# EAGLE design pcb_usb_buttons_deepsleep (EAGLE 7.6.0)
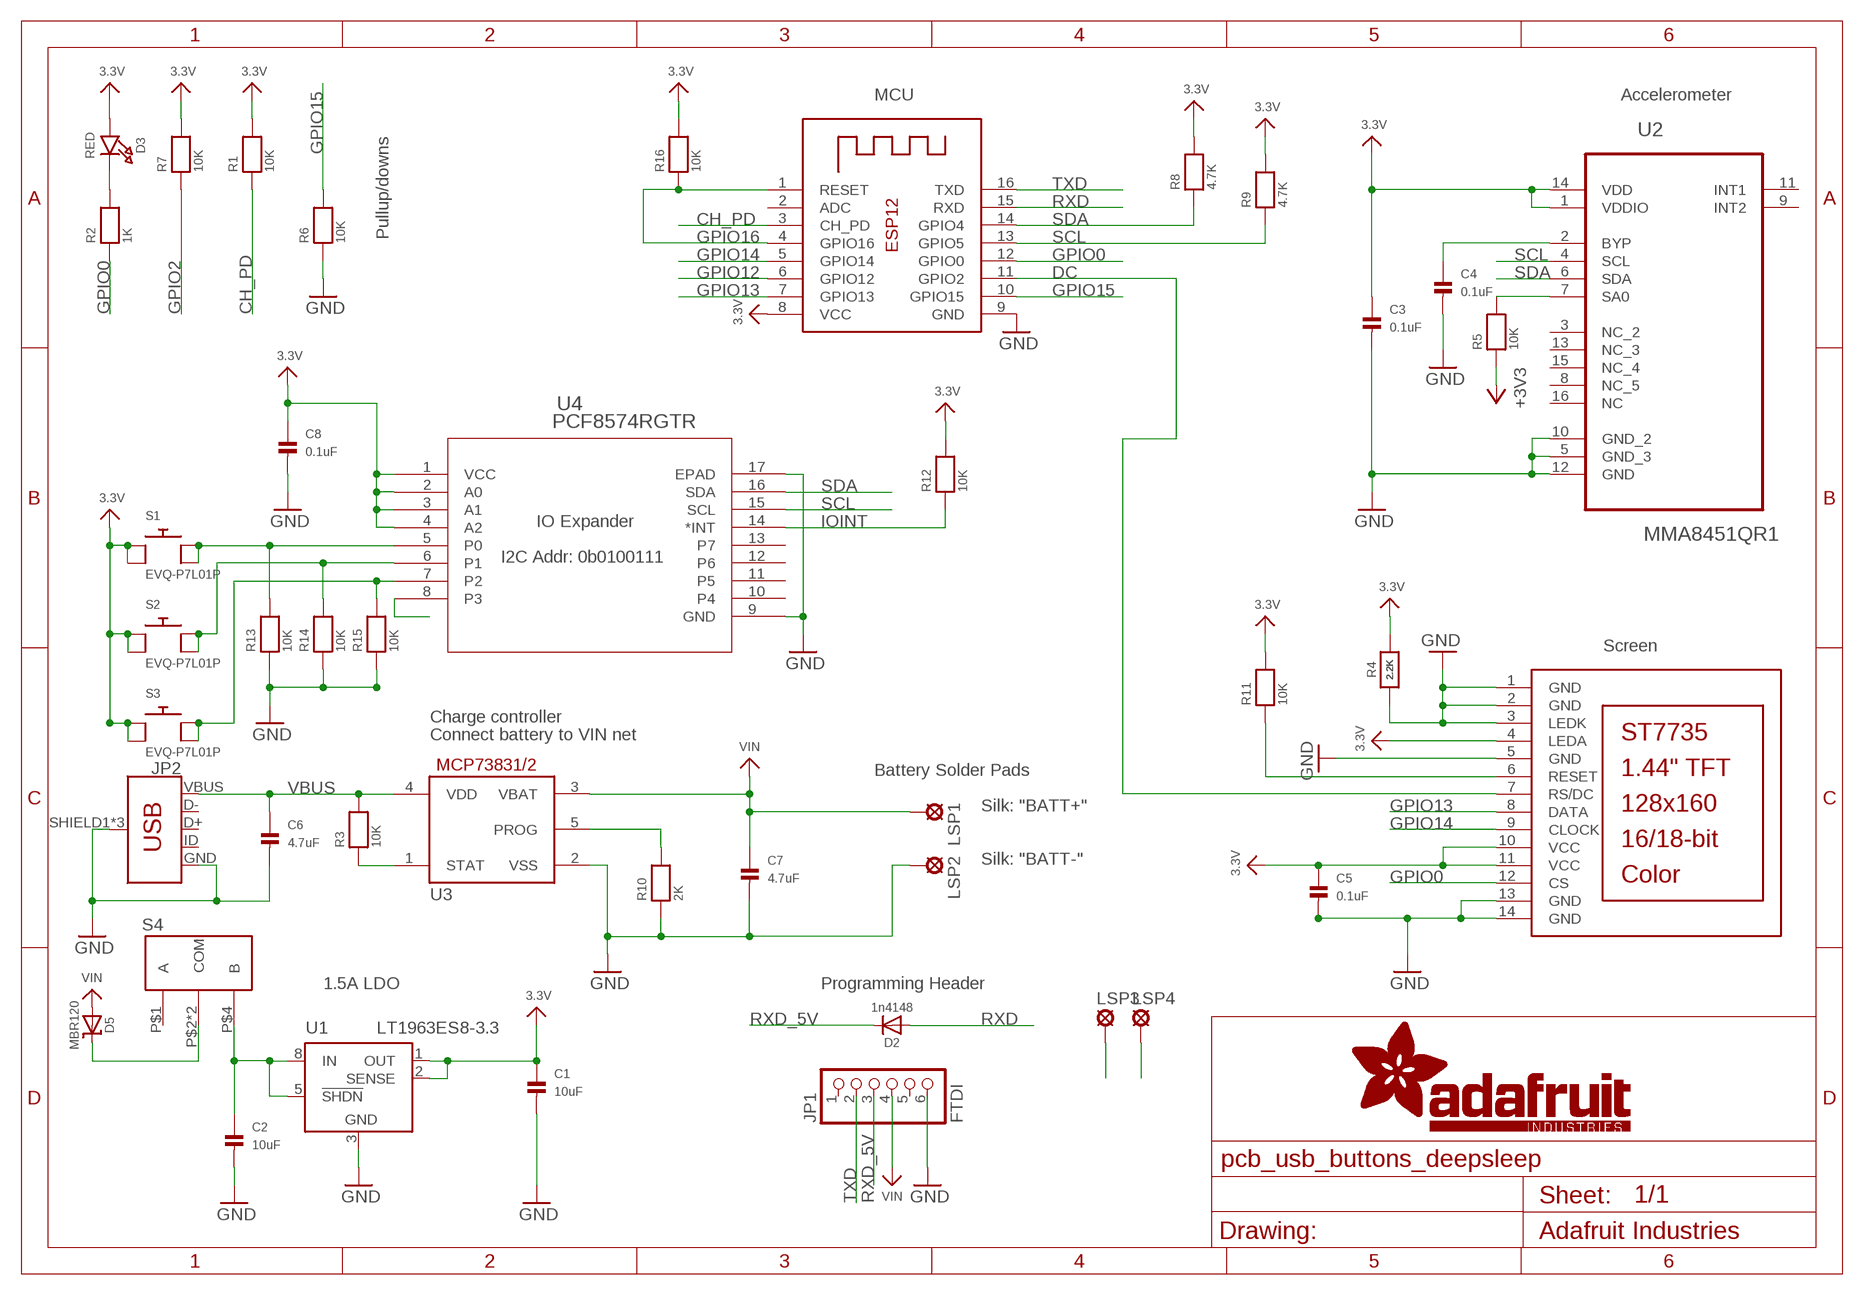
[diagram p0: schematic, sheet 1]

## Parts
C1  10uF  CAP_CERAMIC0805  [0805]
C2  10uF  CAP_CERAMIC0805  [0805]
C3  0.1uF  CAP_CERAMIC0805  [0805]
C4  0.1uF  CAP_CERAMIC0805  [0805]
C5  0.1uF  CAP_CERAMIC0805  [0805]
C6  4.7uF  CAP_CERAMIC0805  [0805]
C7  4.7uF  CAP_CERAMIC0805  [0805]
C8  0.1uF  CAP_CERAMIC0805  [0805]
D2  1n4148  DIODESOD-323  [SOD-323]
D3  RED  LED0805_NOOUTLINE  [CHIPLED_0805_NOOUTLINE]
D5  MBR120  DIODE-SCHOTTKYSOD-123  [SOD-123]
JP1  FTDI  HEADER-1X670MIL  [1X06_ROUND_70]
JP2  USB_MICRO-B_FEMALE-SMT  [USB-B-MICRO-SMD]
LSP1  LSP10  [LSP10]
LSP2  LSP10  [LSP10]
LSP3  LSP10  [LSP10]
LSP4  LSP10  [LSP10]
R1  10K  RESISTOR0805  [0805]
R2  1K  RESISTOR0805  [0805]
R3  10K  RESISTOR0805  [0805]
R4  2.2K  RESISTOR0805_NOOUTLINE  [0805-NO]
R5  10K  RESISTOR0805  [0805]
R6  10K  RESISTOR0805  [0805]
R7  10K  RESISTOR0805  [0805]
R8  4.7K  RESISTOR0805  [0805]
R9  4.7K  RESISTOR0805  [0805]
R10  2K  RESISTOR0805  [0805]
R11  10K  RESISTOR0805  [0805]
R12  10K  RESISTOR0805  [0805]
R13  10K  RESISTOR0805  [0805]
R14  10K  RESISTOR0805  [0805]
R15  10K  RESISTOR0805  [0805]
R16  10K  RESISTOR0805  [0805]
S1  EVQ-P7L01P  [EVQ-P7L]
S2  EVQ-P7L01P  [EVQ-P7L]
S3  EVQ-P7L01P  [EVQ-P7L]
S4  ESD165236  [ESD165236]
TFT1  DISP_LCD_ST7735_1.44IN  [TFT_1.44IN_128_128]
U1  LT1963ES8-3.3  [SOIC8]
U2  MMA8451QR1  [QFN50P300X300X100-16N]
U3  MCP73831/OT  [SOT23-5L]
U4  PCF8574RGTR  [RGT16_1P6X1P6]
X1  ESP-12  [ESP-12]

## Nets
3.3V: C1.1 C3.1 C5.1 C8.1 D3.A R1.2 R4.2 R5.1 R7.2 R8.2 R9.2 R11.2 R12.2 R16.2 S1.P$1 S1.P$1@2 S2.P$1 S2.P$1@2 S3.P$1 S3.P$1@2 TFT1.4(LEDA) TFT1.10(VCC) TFT1.11(VCC) U1.1(OUT) U1.2(SENSE) U2.1(VDDIO) U2.14(VDD) U4.1(VCC) U4.2(A0) U4.3(A1) U4.4(A2) X1.8(VCC) ; supply symbol labelled +3V3
CH_PD: R1.1 X1.3(CH_PD)
DC: TFT1.7(RS/DC) X1.11(GPIO2)
DISC: LSP3.MP U4.8(P3)
GND: C1.2 C2.2 C3.2 C4.2 C5.2 C6.2 C7.2 C8.2 JP1.6 JP2.GND JP2.SHIELD1(SHIELD) JP2.SHIELD2(SHIELD) JP2.SHIELD3(SHIELD) LSP2.MP LSP4.MP R4.1 R6.1 R10.1 R13.1 R14.1 R15.1 TFT1.1(GND) TFT1.2(GND) TFT1.3(LEDK) TFT1.5(GND) TFT1.13(GND) TFT1.14(GND) U1.3(GND) U2.5(GND_3) U2.10(GND_2) U2.12(GND) U3.2(VSS) U4.9(GND) U4.17(EPAD) X1.9(GND)
GPIO0: R2.1 TFT1.12(CS) X1.12(GPIO0)
GPIO2: R7.1
GPIO12: X1.6(GPIO12)
GPIO13: TFT1.8(DATA) X1.7(GPIO13)
GPIO14: TFT1.9(CLOCK) X1.5(GPIO14)
GPIO15: R6.2 X1.10(GPIO15)
GPIO16: R16.1 X1.1(RESET) X1.4(GPIO16)
IOINT: R12.1 U4.14(*INT)
N$1: D3.C R2.2
N$2: C2.1 S4.P$4(B) U1.5(!SHDN) U1.8(IN)
N$4: R11.1 TFT1.6(RESET)
N$5: R3.1 U3.1(STAT)
N$6: R10.2 U3.5(PROG)
N$7: R13.2 S1.P$2 S1.P$2@2 U4.5(P0)
N$8: R5.2 U2.7(SA0)
N$9: C4.1 U2.2(BYP)
N$10: R14.2 S2.P$2 S2.P$2@2 U4.6(P1)
N$11: R15.2 S3.P$2 S3.P$2@2 U4.7(P2)
N$13: D5.C S4.P$2(COM) S4.P$3(COM)
RXD: D2.A X1.15(RXD)
RXD_5V: D2.C JP1.3
SCL: R9.1 U2.4(SCL) U4.15(SCL) X1.13(GPIO5)
SDA: R8.1 U2.6(SDA) U4.16(SDA) X1.14(GPIO4)
TXD: JP1.2 X1.16(TXD)
VBUS: C6.1 JP2.VBUS R3.2 U3.4(VDD)
VIN: C7.1 D5.A JP1.4 LSP1.MP U3.3(VBAT)
Unconnected: JP1.1 JP1.5 JP2.D+ JP2.D- JP2.ID S4.P$1(A) U1.4(NC) U2.3(NC_2) U2.8(NC_5) U2.9(INT2) U2.11(INT1) U2.13(NC_3) U2.15(NC_4) U2.16(NC) U4.10(P4) U4.11(P5) U4.12(P6) U4.13(P7) X1.2(ADC)

## Notes on the sheet
- MCU | Accelerometer
- Pullup/downs
- IO Expander
- I2C Addr: 0b0100111
- Screen
- Charge controller
- Connect battery to VIN net
- Battery Solder Pads
- Silk: "BATT+"
- Silk: "BATT-"
- 1.5A LDO | Programming Header

## Power pins joined to a net without a drawn wire
GND: U1.6(GND) U1.7(GND)

## Library data of the parts
C1-C8 = microbuilder:CAP_CERAMIC: Ceramic Capacitors 0402 - 0402 Surface Mount Capacitors 16pF 50V 5% [Digikey: 445-4899-2-ND] 18pF 50V 5% [Digikey: 490-1281-2-ND] 22pF 50V 5% [Digikey: 490-1283-2-ND] 68pF 50V 5% [Digikey: 490-1289-2-ND] 0.1uF 10V 10% [Digikey: 490-1318-2-ND] 1.0uF 6.3V 10% [Digikey: 490-1320-2-ND] 0603 - 0603 Surface Mount Capacitors 16 pF 50V 5% [Digikey: 445-5051-2-ND] 22 pF 50V [Digikey: PCC220ACVTR-ND] 33 pF 50V 5% [Digikey: 490-1415-1-ND] 56pF 50V 5% [Digikey: 490-1421-1-ND] 220pF 50V 5% [Digikey: 445-1285-1-ND] 680 pF 50V 2200 pF 50V 5% C0G [Digikey: 445-1297-1-ND] 5600 pF 100V 5% X7R [Digikey: 478-3711-1-ND] 0.1 µF 25V 10% [Digikey: PCC2277TR-ND] 0.22 µF 16V 10% X7R [Digikey: 445-1318-1-ND] 1.0 µF 25V 10% [Digikey: 445-5146-2-ND] 0603 - RF Specific 3pF 250V +/-0.1pF RF [Digikey: 712-1347-1-ND] 18 pF 250V 5% [Digikey: 478-3505-1-ND or 712-1322-1-ND] 56 pF 250V 5% C0G RF [Digikey: 490-4867-1-ND] 68 pF 250V RF [Digikey: 490-4868-1-ND] 0805 - 0805 Surface Mount Capacitors 220 pF 250V 2% RF Ceramic Capacitor [Digikey: 712-1398-1-ND] 1000 pF 50V 2% NP0 Ceramic Capacitor [Digikey: 478-3760-1-ND] 0.1 µF 25V 10% Ceramic Capacitor [Digikey: PCC1828TR-ND] 1.0 µF 16V 10% Ceramic Capacitor[Digikey: 490-1691-2-ND] 10.0 µF 10V 10% Ceramic Capacitor[Digikey: 709-1228-1-ND] 10.0 uF 16V 10% Ceramic Capacitor [Digikey: 478-5165-2-ND] 47 uF 6.3V 20% Ceramic Capacitor [Digikey: 587-1779-1-ND or 399-5506-1-ND] 1206 - 1206 Surface Mount Capacitors 47uF 10V 20% Ceramic Capacitor [Digikey: 490-5528-1-ND or 399-5508-1-ND or 445-6010-1-ND]
D2 = microbuilder:DIODE: Diode SMA Model Volts Amps Type Vf Ir Digikey # Notes SSA34-E3 40V 3A Schottky 480mV @ 3A 200uA @ 40V SSA34-E3/61TGITR-ND CDBA120-G 20V 1A Schottky 500mV @ 1A 500uA @ 20V 641-1014-6-ND REEL MBRA210 10V 2A Schottky 350mV @ 2A 700uA @ 10V MBRA210LT3 SOD-123 Model Volts Amps Type Vf Ir Order # Notes BAT54T1G 30V 200mA Schottky 800mV @ 200mA 2uA @ 25V BAT54T1GOSTR-ND B0530W 30V 500mA Schottky 430mV @ 500mA 130uA @ 30V B0530W-FDICT-ND REEL MBR120 20V 1A Schottky 340mV @ 1A MBR120VLSFT1GOSCT-ND SOD-323 Model Volts Amps Type Vf Ir Order # Notes PMEG2005EJ 20V 500mA Schottky 355mV @ 500mA 568-4110-1-ND ZLLS410 10V 570mA Schottky 380mV @ 570mA ZLLS410CT-ND 1N4148WS 75V 150mA Silicon/Simple 1V 1N4148WSFSCT-ND REEL SOD-523 Model Volts Amps Type Vf Ir Order # Notes BAT54XV2 30V 200mA Schottky 0.8V @ 100mA BAT54XV2CT-ND TB751S 30V 30mA Schottky RB751S-40TE61CT-ND SOT23-R/W (R = Solder Paste/Reflow Ovens, W = Hand-Soldering) Model Volts Amps Type Vf Ir Order # Notes BAT54FILM 40V 300mA Schottky 497-7162-1-ND POWERDI-5 Model Volts Amps Type Vf Ir Order # Notes PDS560 60V 5A Schottky 670mV @ 5A 150uA @ 60V PDS560DICT-ND
D3 = microbuilder:LED: LED 0603 - 0603 Surface Mount Package 2mA: Green LED - Low Power (3.9mcd, 2ma, 1.7Vf) - Digikey: 475-2709-2-ND Orange LED - Low Power (9.8mcd, 2ma, 1.8Vf) - Digikey: 475-1194-2-ND Red LED - Low Power (5mcd, 2ma, 1.8Vf) - Digikey: 475-1195-2-ND Yellow LED - Low Power (7mcd, 2ma, 1.8Vf) - Digikey: 475-1196-2-ND 5mA: Blue LED - Low Power (17mcd, 5ma, 2.9Vf) - Digikey: LNJ937W8CRACT-ND 0805 - 0805 Surface Mount Package 2mA: Red LED (8.8mcd, 2mA, 1.8Vf, Clear) - Low Power [Digikey: 475-2510-1-ND] Green LED (5mcd, 2mA, 1.8Vf, Clear) - Low Power [Digikey: 475-2730-1-ND] Yellow LED (11.3mcd, 2mA, 1.8Vf, Clear) - Low Power [Digikey: 475-2555-1-ND] 20mA: Red LED (104mcd, 20mA, Diffused) - LS R976 [Digikey: 475-1278-6-ND] Red LED (12mcd, 20mA, 2.0Vf, Clear) - APT2012EC [Digikey: 754-1128-1-ND] Green LED (15mcd, 20mA, 2.2Vf, Clear) - APT2012GC [Digikey: 754-1131-1-ND] Orange LED (160mcd, 20mA, 2.1Vf, Clear) - APT2012SECK [Digikey: 754-1130-1-ND] 1206 - 1206 Surface Mount Package Green LED (26mcd, 20mA, Diffused) - LG N971 [Digikey: 475-1407-6-ND] Red LED (15mcd, 20mA, Diffused) - LH N974 [Digikey: 475-1416-6-ND] Cree - Cree High-Power Surface Mount LEDs XPEBWT-L1-0000-00D50 - White 111lm 350mA 2.9Vf 6200K 110° XTEAWT-00-0000-00000LEE3 - White 114lm 350mA 2.85Vf 5000K 115° Everlight - Everlight 45-21 Series Surface Mount LEDs 45-21/QK2C-B2832AC2CB2/2T - Warm White 2000mcd 20mA 3.25Vf 3050K 120° 45-21/LK2C-B38452C4CB2/2T - Nuetral White 2000mcd 20mA 3.25Vf 4150K 120° 45-21/LK2C-B50634C6CB2/2T - Cold White 2200mcd 20mA 3.25Vf 5650K 120° PLCC2 Reverse Mount LS T77K-J1L2-1-0-2-R18-Z - Red 11.25mcd 2mA 1.8Vf 630nm 120° LO T77K-L1M2-24-Z - Orange 19.6mcd 2mA 1.8Vf 606nm 120° LY T77K-K2M1-26-Z - Yellow 15.7mcd 2mA 1.8Vf 587nm 120°
D5 = microbuilder:DIODE-SCHOTTKY
JP1 = microbuilder:HEADER-1X6: PIN HEADER
JP2 = SparkFun-Connectors:USB_MICRO-B: USB Type Micro-B Connector Male/female and PTH/SMT variants SparkFun Products: SparkFun microB USB Breakout <https://www.sparkfun.com/products/12035> SparkFun USB microB Plug Breakout <https://www.sparkfun.com/products/10031> SparkFun ESP8266 Thing <https://www.sparkfun.com/products/13231>; PROD_ID: CONN-11752
LSP1-LSP4 = solpad:LSP10: SOLDER PAD drill 1.0 mm, distributor Buerklin, 12H555
R1-R3 R5-R16 = microbuilder:RESISTOR: Resistors
R4 = Adafruit TFT144 Breakout:RESISTOR: Resistors
S1-S3 = FitnessBandLib:EVQ-P7L01P
S4 = FitnessBandLib:ESD165236
TFT1 = Adafruit TFT144 Breakout rev B:DISP_LCD_ST7735_1.44IN
U1 = linear-technology:LT1963ES8: 1.5A, Low Noise, Fast Transient Response LDO Regulator Source: http://www.linear.com/pc/downloadDocument.do?navId=H0,C3,P2222,D3148; MPN: LT1963ES8-3.3; OC_FARNELL: unknown; OC_NEWARK: 57M7563
U2 = Freescale_By_element14_Batch_1:MMA8451QR1: 3-Axis, 14-bit/8-bit Digital Accelerometer; MPN: MMA8451QR1; OC_FARNELL: 1908021; OC_NEWARK: 84R7350; PACKAGE: QFN-16; SUPPLIER: Freescale
U3 = adafruit:MCP73831: MCP73831/2 Miniature Single-Cell, Fully Integrated Li-Ion, Li-Polymer Charge Management Controllers. Nice and small simple lipoly charge controller, with adjustable current and status output (LED) http://www.ladyada.net/library/pcb/eaglelibrary.html
U4 = PCF8574RGTR:PCF8574RGTR; 3D_LIBRARY_NAME: TI_AllParts_20121225; COPYRIGHT: Copyright C 2015 Accelerated Designs. All rights reserved; DATASHEETURL: httpwww.ti.comlitgpnPCF8574; FAMILY_NAME: I2C IO EXPANDER; GENERIC_PART_NUMBER: PCF8574; INDUSTRY_STD_PKG_TYPE: QFN; MANUFACTURER: Texas Instruments; MANUFACTURER_PART_NUMBER: PCF8574RGTR; PACKAGE_DESIGNATOR: RGT; PIN_COUNT: 16; VENDOR: Texas Instruments
X1 = microbuilder:ESP-12

## Board
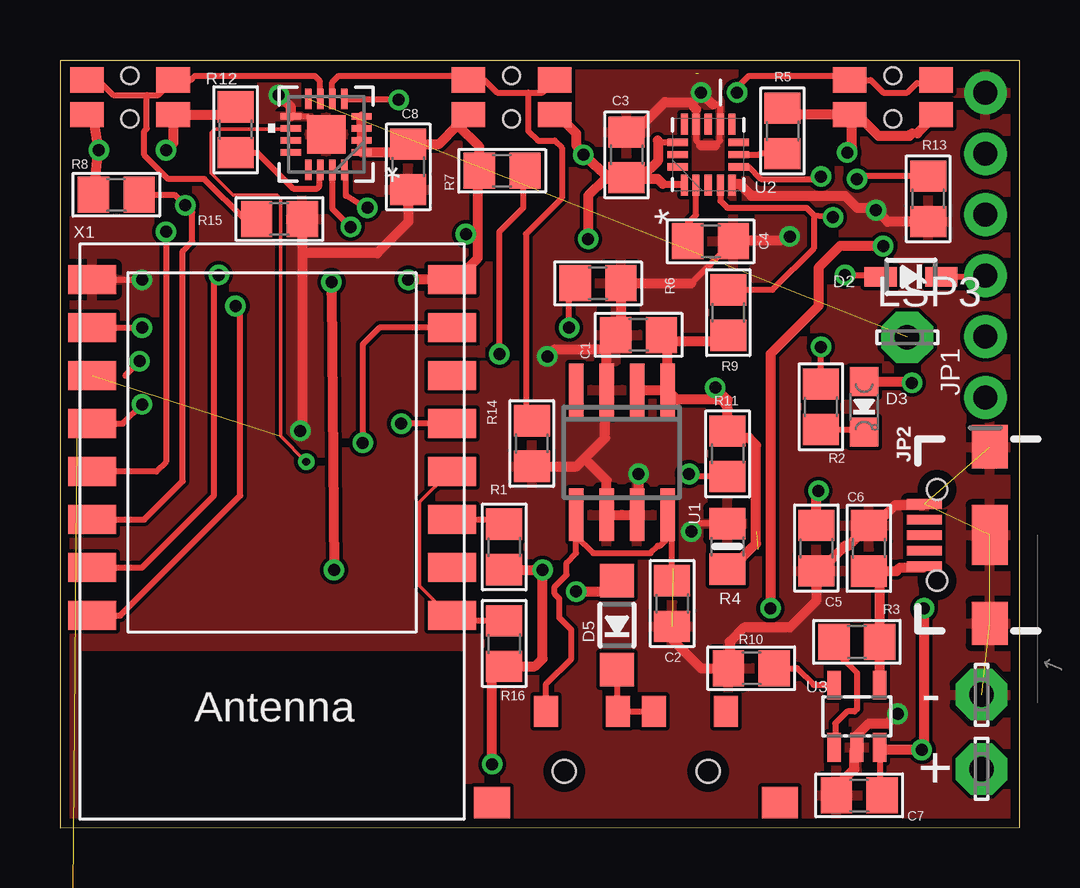
[diagram p1: board, top side]
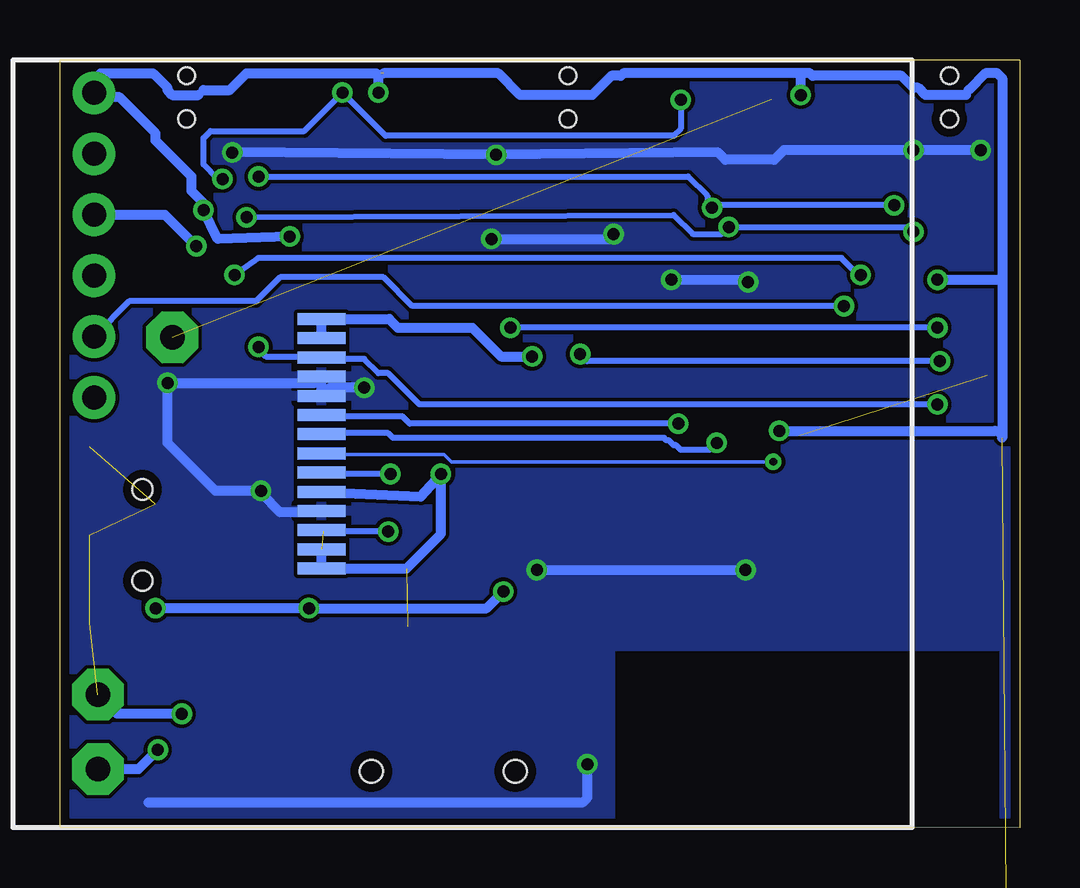
[diagram p2: board, bottom side, seen from below]

Size 40 x 32 mm. Coordinates in mm from the lower left corner, seen from the top.
Outline: 0,0 40,0.01 40,32 0,32 0,0
Copper layers (1*16): Top 0.0356mm / dielectric 1.5011mm / Bottom 0.0356mm
Design rules "oshpark-2layer": minimum track width 6mil, minimum drill 13mil, track to track 6mil, track to pad 6mil, pad to pad 6mil, via to via 6mil, smd to smd 6mil, copper to edge 15mil, drill to drill 6mil, minimum pad ring 7mil, minimum via ring 7mil, stop-mask expansion 2.5mil, vias tented up to drill 0mil, thermal gap 10mil

### Footprints (pad centres in the part's own frame; a part is rotated, then mirrored left to right if it is on the bottom)
0805 = smd 1.3 x 1.5: 1 -0.95,0; 2 0.95,0
SOD-323 = smd 1.35 x 0.8: A 1.27,0; C -1.27,0
CHIPLED_0805_NOOUTLINE = smd 1.2 x 1.2: A 0,-1.05; C 0,1.05
SOD-123 = smd 1.4 x 1.4: A 1.85,0; C -1.85,0
1X06_ROUND_70 = drill 1 pad 1.778: 1 -6.35,0; 2 -3.81,0; 3 -1.27,0; 4 1.27,0; 5 3.81,0; 6 6.35,0
USB-B-MICRO-SMD = smd 1.45 x 0.4: D+ 2.725,0; D- 2.725,0.65; GND 2.725,-1.3; ID 2.725,-0.65; VBUS 2.725,1.3 | smd 1.5 x 1.8: SHIELD1 0,3.685; SHIELD2 0,-3.685 | smd 1.5 x 2.5: SHIELD3 0,0 | hole 0.85: 2.2,1.9; 2.2,-1.9
LSP10 = drill 1.016 pad 2.159 octagon: MP 0,0
0805-NO = smd 1.3 x 1.5: 1 -0.95,0; 2 0.95,0
EVQ-P7L = smd 1.4 x 1.05: P$1 -1.8,-0.725; P$1@2 1.8,-0.725; P$2 -1.8,0.725; P$2@2 1.8,0.725 | hole 0.7: 0,0.9; 0,-0.9
ESD165236 = smd 1 x 1.3: P$1 3.75,2.5; P$2 0.75,2.5; P$3 -0.75,2.5; P$4 -3.75,2.5 | smd 1.5 x 1.3: P$5 6,-1.3; P$6 -6,-1.3 | hole 0.95: 3,0; -3,0
TFT_1.44IN_128_128 = smd 0.5 x 2: 1 5.2,12.855; 2 4.4,12.855; 3 3.6,12.855; 4 2.8,12.855; 5 2,12.855; 6 1.2,12.855; 7 0.4,12.855; 8 -0.4,12.855; 9 -1.2,12.855; 10 -2,12.855; 11 -2.8,12.855; 12 -3.6,12.855; 13 -4.4,12.855; 14 -5.2,12.855
SOIC8 = smd 0.6 x 2.2: 1 -1.905,-2.6; 2 -0.635,-2.6; 3 0.635,-2.6; 4 1.905,-2.6; 5 1.905,2.6; 6 0.635,2.6; 7 -0.635,2.6; 8 -1.905,2.6
QFN50P300X300X100-16N = smd 0.864 x 0.305: 1 -1.27,0.991; 2 -1.27,0.508; 3 -1.27,0; 4 -1.27,-0.508; 5 -1.27,-0.991; 9 1.27,-0.991; 10 1.27,-0.508; 11 1.27,0; 12 1.27,0.508; 13 1.27,0.991 | smd 0.305 x 0.864: 6 -0.508,-1.27; 7 0,-1.27; 8 0.508,-1.27; 14 0.508,1.27; 15 0,1.27; 16 -0.508,1.27
SOT23-5L = smd 0.55 x 1.2: 1 -0.95,-1.3; 2 0,-1.3; 3 0.95,-1.3; 4 0.95,1.3; 5 -0.95,1.3
RGT16_1P6X1P6 = smd 0.85 x 0.28: 1 -1.475,0.75; 2 -1.475,0.25; 3 -1.475,-0.25; 4 -1.475,-0.75; 9 1.475,-0.75; 10 1.475,-0.25; 11 1.475,0.25; 12 1.475,0.75 | smd 0.28 x 0.85: 5 -0.75,-1.475; 6 -0.25,-1.475; 7 0.25,-1.475; 8 0.75,-1.475; 13 0.75,1.475; 14 0.25,1.475; 15 -0.25,1.475; 16 -0.75,1.475 | smd 1.6 x 1.6: 17 0,0
ESP-12 = smd 2 x 1.2: 1 -7.5,4.5; 2 -7.5,2.5; 3 -7.5,0.5; 4 -7.5,-1.5; 5 -7.5,-3.5; 6 -7.5,-5.5; 7 -7.5,-7.5; 8 -7.5,-9.5; 9 7.5,-9.5; 10 7.5,-7.5; 11 7.5,-5.5; 12 7.5,-3.5; 13 7.5,-1.5; 14 7.5,0.5; 15 7.5,2.5; 16 7.5,4.5

### Placement (x,y rotation side)
C1  24.12,20.54 180 top
C2  25.52,9.34 270 top
C3  23.62,28.04 90 top
C4  27.12,24.44 0 top
C5  31.53,11.65 270 top
C6  33.72,11.64 90 top
C7  33.32,1.34 180 top
C8  14.52,27.54 270 top
D2  35.47,22.96 180 top
D3  33.52,17.54 180 top
D5  23.22,8.44 90 top
JP1  38.58,24.28 90 top
JP2  38.76,12.19 180 top
LSP1  38.42,2.44 90 top
LSP2  38.42,5.54 90 top
LSP3  35.32,20.44 0 top
LSP4  0.52,-7.46 0 top  (outside the outline)
R1  18.52,11.7 270 top
R2  31.72,17.54 270 top
R3  33.22,7.74 0 top
R4  27.82,11.72 270 top
R5  30.12,29.04 270 top
R6  22.43,22.69 180 top
R7  18.43,27.38 180 top
R8  2.35,26.38 180 top
R9  27.86,21.47 270 top
R10  28.82,6.64 0 top
R11  27.83,15.58 90 top
R12  7.32,29.09 90 top
R13  36.19,26.21 90 top
R14  19.67,16.01 90 top
R15  9.15,25.37 180 top
R16  18.52,7.67 270 top
S1  34.72,30.44 0 top
S2  18.82,30.44 0 top
S3  2.92,30.44 0 top
S4  24.02,2.34 0 top
TFT1  41.95,16 270 bottom
U1  23.42,15.64 180 top
U2  27.02,28.05 90 top
U3  33.22,4.64 0 top
U4  11.1,28.9 180 top
X1  8.84,13.34 180 top

### Tracks (layer width: path | path; a pad name or v marks a point on that pad's centre or on a via)
3.3V  (via drill 0.5)
  Top 0.254: v20.11,10.75 v20.12,10.74 | 18.02,6.22 R16.2 | 1.6,28.22 v1.62,28.24 | S1.P$1 33.02,29.61 33.34,29.61 | 35.52,28.94 35.74,28.94 | 30.39,29.71 R5.1 | 24.92,27.04 24.87,27.09 24.22,27.09 C3.1 22.88,27.09 | U2.14 25,28.56 24.92,28.64 | S2.P$1@2 20.74,29.71 | U4.3 U4.2 U4.1 | 14.18,28.15 C8.1 | 16.58,29.28 S2.P$1 | 1.42,29.42 S3.P$1 | 7,29.71 R12.2 | X1.8 16.52,22.84 | 17.42,27.32 R7.2 | 25.32,20.29 C1.1 | 27.62,20.29 R9.2 | 27.83,17.43 27.42,17.84 | 35.47,18.59 v35.52,18.54 | 31.53,13.95 v31.62,14.04 | R4.2 27.95,10.77 | 28.12,16.24 R11.2 | 17.02,24.74 17.42,24.34 | 25.12,26.84 25.97,26.84 U2.1 25.18,26.78 25.12,26.84
  Top 0.406: R1.2 v20.11,10.75 | v11.42,10.74 11.32,22.24 v11.32,22.74 | v18.02,2.64 18.02,6.22 | R16.2 19.8,6.72 20.12,7.04 v20.12,10.74 | R8.2 1.6,28.22 | v32.82,28.14 33.02,28.34 33.02,29.61 | 33.34,29.61 34.12,28.84 35.42,28.84 35.52,28.94 | 35.74,28.94 S1.P$1@2 | S1.P$1 30.39,29.71 | 25.12,26.84 24.92,27.04 22.72,27.04 22.02,26.34 v22.02,24.54 | 24.92,28.64 24.92,27.79 24.22,27.09 | 20.74,29.71 21.52,28.94 21.52,28.45 v21.82,28.05 22.88,27.09 | U4.4 U4.3 U4.1 14.18,28.15 | C8.1 15.79,28.49 16.58,29.28 17.48,28.38 R7.2 | v1.62,28.24 1.42,29.42 | v4.42,28.24 4.72,28.54 S3.P$1@2 7,29.71 | 16.52,22.84 17.42,23.74 17.42,24.34 17.42,27.32 | U1.2 U1.1 | U1.1 25.32,20.29 27.62,20.29 | X1.8 v14.52,22.84 | R11.2 27.83,17.43 27.83,17.83 v27.32,18.34 | 27.42,17.84 25.72,17.84 U1.1 | D3.A 35.47,18.59 | C5.1 31.53,13.95 | 27.95,10.77 29.02,11.84 29.02,15.94 28.72,16.24 28.12,16.24 | v16.92,24.74 17.02,24.74
  Bottom 0.254: v32.81,28.15 v32.82,28.14 | 11.42,22.84 v11.32,22.74 | 29.35,18.54 TFT1.11 | v31.62,14.04 31.62,13.94 31.72,14.04 | 29.16,13.14 TFT1.4
  Bottom 0.406: v20.12,10.74 v11.42,10.74 | 36.32,1.04 18.22,1.04 18.02,1.24 v18.02,2.64 | v1.62,28.24 v4.42,28.24 9.82,28.24 10.22,27.84 12.27,27.84 U4.1 v21.82,28.05 v32.81,28.15 | v14.52,22.84 11.42,22.84 | v27.32,18.34 28.75,18.34 TFT1.10 TFT1.11 | 29.35,18.54 v35.52,18.54 35.52,16.04 33.52,14.04 31.72,14.04 | 31.62,13.94 30.82,13.14 29.16,13.14 | v22.02,24.54 17.12,24.54 v16.92,24.74
  pour Bottom: 0,32 0,0 40,0.02 40,32
CH_PD
  Top 0.254: X1.3 18.33,12.84 R1.1
DC  (via drill 0.33)  (1 unrouted)
  Top 0.152: 9.5,29.12 6.45,29.12 6.3,28.96 6.3,27.29 7.22,26.37 9.05,26.37 9.2,26.22 9.2,16.32 v10.27,15.25
  Bottom 0.152: v10.27,15.25 23.68,15.25 23.98,15.55 29.01,15.55 TFT1.7
DISC  (1 unrouted)
GND  (via drill 0.5)  (8 unrouted)
  Top 0.254: X1.9 v3.42,22.84 | C3.2 23.97,28.99 | 26.42,30.24 26.42,30.04 | 26.52,29.94 U2.12 26.51,28.65 26.72,28.44 | 27.32,28.44 27.52,28.64 U2.10 27.53,30.03 27.42,30.14 27.22,30.14 | 28.01,24.5 C4.2 26.32,22.69 | 28.07,26.84 U2.5 | 23.38,20.75 C1.2 | 22.79,20.16 C1.2 | U4.9 10.31,29.65 10.62,29.34 10.66,29.34 U4.17 | 33.92,25.84 v34.02,25.74 | 22.57,19.94 C1.2 | 22.72,18.18 U1.3 | C2.2 25.52,7.84 | C7.2 32.37,1.69 | 33.12,3.24 U3.2 33.22,3.84 | C6.2 33.97,12.59 | 35.98,13.44 JP2.GND | C5.2 31.68,10.7 | 32.72,11.74 32.87,11.74 | 24.12,13.11 U1.7 | 27.92,6.69 R10.1 | R4.1 26.65,12.67 v26.32,12.34
  Top 0.406: R13.1 34.5,25.26 v34.02,25.74 | 23.97,28.99 25.22,30.24 26.42,30.24 | 26.42,30.04 26.52,29.94 | 26.72,28.44 27.32,28.44 | 27.22,30.14 v26.72,30.64 | 23.38,20.75 R6.1 26.32,22.69 | U1.3 22.79,20.16 | R15.1 10.1,23.94 | 10.1,23.94 10.1,16.62 v10.02,16.54 | U4.9 9.62,30.04 v9.12,30.54 | C8.2 14.52,25.24 13.22,23.94 10.1,23.94 | 28.07,26.84 28.32,26.84 28.82,26.34 32.72,26.34 33.22,25.84 33.92,25.84 | 28.01,24.5 30.08,24.5 v30.42,24.64 | v20.32,19.64 20.62,19.94 22.57,19.94 | R14.1 21.54,15.06 21.87,15.39 | 21.87,15.39 22.72,16.24 22.72,18.18 | U1.7 U1.6 22.79,14.48 21.87,15.39 | 25.52,7.84 26.72,6.64 R10.1 | 32.37,1.69 33.12,2.44 33.12,3.24 | 33.22,3.84 33.72,4.34 34.52,4.34 v34.92,4.74 | 33.97,12.59 34.82,13.44 35.98,13.44 | 31.68,10.7 32.72,11.74 | 32.87,11.74 C6.2 | v24.12,14.74 24.12,13.11 | C5.2 31.53,9.45 30.42,8.34 28.52,8.34 27.92,7.74 27.92,6.69
  Bottom 0.254: 38.58,31.18 38.32,31.44 | 0.82,22.84 0.72,22.94 | v34.02,25.74 34.02,26.04 | 26.62,31.44 26.72,31.34 26.82,31.44 | 1.02,16.54 0.72,16.24 | 35.52,30.84 35.52,30.74 | 34.22,30.54 34.02,30.74 | 2.12,30.74 2.12,30.64 2.22,30.54 | 8.62,31.34 8.72,31.44 | 16.52,31.44 16.62,31.34 | 26.52,31.44 26.62,31.34 | v26.32,12.34 29.03,12.34 TFT1.3
  Bottom 0.406: 38.58,31.18 JP1.6 38.39,30.44 37.52,30.44 36.02,28.94 36.02,28.64 34.52,27.14 34.52,26.54 34.02,26.04 | 0.72,16.24 0.72,22.94 0.72,31.24 0.92,31.44 1.42,31.44 2.12,30.74 | v3.42,22.84 0.82,22.84 | v26.72,30.64 26.72,31.34 | v10.02,16.54 1.02,16.54 | v9.12,30.54 9.12,31.44 | v30.42,24.64 33.42,24.54 v34.02,25.74 | TFT1.13 TFT1.14 26.28,21.2 25.92,20.84 22.82,20.84 21.62,19.64 v20.32,19.64 | v34.92,4.74 37.62,4.74 LSP2.MP | TFT1.5 24.96,13.8 v24.12,14.74 24.12,12.24 25.56,10.8 TFT1.1 TFT1.2 | 38.32,31.44 36.12,31.44 35.52,30.84 | 35.52,30.74 35.32,30.54 34.22,30.54 | 34.02,30.74 32.92,30.74 32.22,31.44 26.82,31.44 | 2.22,30.54 3.92,30.54 4.22,30.84 4.42,30.84 4.92,31.34 8.62,31.34 | 8.72,31.44 9.12,31.44 | 9.12,31.44 16.52,31.44 | 16.62,31.34 17.02,31.34 17.82,30.54 20.82,30.54 21.72,31.44 26.52,31.44
  pour Top: 0,32 0,0 40,0.02 40,32
GPIO0  (via drill 0.5)
  Top 0.254: X1.12 2.62,16.84 v3.42,17.64 | R2.1 v31.72,20.04
  Bottom 0.254: v3.42,17.64 25.02,17.64 26.32,18.94 26.72,18.94 27.32,19.54 29.03,19.54 TFT1.12 29.13,19.64 31.42,19.64 31.72,19.94 v31.72,20.04
GPIO2  (via drill 0.5)
  Top 0.254: 2.72,18.84 v3.32,19.44 | v18.32,19.74 18.32,24.84 19.32,25.84 19.32,27.32 R7.1
  Bottom 0.254: v3.32,19.44 18.02,19.44 v18.32,19.74
GPIO13  (via drill 0.5)
  Top 0.254: X1.7 13.32,20.84 12.62,20.14 v12.62,16.04
  Bottom 0.254: v12.62,16.04 12.92,15.74 14.12,15.74 14.32,15.94 14.42,15.94 14.62,16.14 14.72,16.14 14.82,16.24 26.12,16.24 26.32,16.44 29.05,16.44 TFT1.8
GPIO14  (via drill 0.5)
  Top 0.254: X1.5 v14.22,16.84
  Bottom 0.254: v14.22,16.84 25.42,16.84 25.72,17.14 29.03,17.14 TFT1.9
GPIO15  (via drill 0.5)
  Top 0.254: X1.10 v3.42,20.84 | v21.22,20.84 21.22,22.43 R6.2
  Bottom 0.254: v3.42,20.84 v21.22,20.84
GPIO16
  Top 0.152: X1.4 16.21,14.79 14.99,13.57 14.99,10.07 16.21,8.85 X1.1
  Top 0.254: R16.1 16.56,8.62 X1.1
IOINT
  Top 0.254: R12.1 8.22,28.14 9.72,26.64 10.72,26.64 10.82,26.74 10.82,27.39 U4.14
N$1
  Top 0.254: R2.2 33.42,16.59 D3.C
N$2
  Top 0.254: S4.P$4 20.27,5.99 21.32,7.04 21.32,8.24 20.82,8.74 20.82,9.54 20.62,9.74 20.62,10.04 21.12,10.54 21.12,11.04 21.52,11.44 U1.5 21.52,12.14 22.22,11.44 24.62,11.44 24.92,11.74 25.02,11.74 25.22,11.94 25.22,12.94 U1.8 25.52,12.85 C2.1
N$4  (via drill 0.5)
  Top 0.254: R11.1 26.33,14.63 v26.22,14.74
  Bottom 0.254: v26.22,14.74 29.03,14.74
  Bottom 0.406: 29.03,14.74 TFT1.6
N$5
  Top 0.254: R3.1 32.27,7.39 33.22,6.44 33.22,4.94 33.12,4.84 32.82,4.84 32.32,4.34 32.32,3.39 U3.1
N$6
  Top 0.254: R10.2 30.72,6.64 31.42,5.94 U3.5
N$7  (via drill 0.5)
  Top 0.254: U4.5 14.08,30.38 v14.12,30.34 | v28.22,30.64 28.22,30.84 28.72,31.34 32.74,31.34 S1.P$2 33.8,31.17 34.32,30.64 35.32,30.64 35.72,31.04 36.39,31.04 S1.P$2@2 | R13.2 33.34,27.16 v33.22,27.04
  Bottom 0.254: v33.22,27.04 33.42,27.04 34.02,27.64 34.02,28.74 33.72,29.04 29.82,29.04 v28.22,30.64 26.42,28.84 14.42,28.84 14.12,29.14 v14.12,30.34
N$8
  Top 0.254: R5.2 29.17,28.09 29.12,28.04 U2.7
N$9
  Top 0.254: C4.1 26.17,25.19 26.52,25.54 U2.2
N$10
  Top 0.254: U4.6 11.35,31.07 11.62,31.34 16.84,31.34 S2.P$2 17.7,31.17 18.22,30.64 19.52,30.64 | 19.52,30.64 20.09,30.64 | 20.09,30.64 S2.P$2@2 20.62,31.14 20.12,30.64 20.09,30.64 | 19.52,30.64 19.52,29.04 19.92,28.64 20.62,28.64 20.92,28.34 20.92,26.24 19.42,24.74 19.42,17.21 R14.2
N$11
  Top 0.254: S3.P$2 1.59,31.17 2.22,30.54 3.62,30.54 | 3.62,30.54 4.09,30.54 S3.P$2@2 5.44,31.17 5.62,31.34 10.62,31.34 10.82,31.14 10.82,30.41 U4.7 | R15.2 7.69,25.37 6.02,27.04 4.52,27.04 3.52,28.04 3.52,29.04 3.62,29.14 3.62,30.54
N$13
  Top 0.254: D5.C 23.22,4.89 S4.P$3 S4.P$2
RXD  (via drill 0.5)
  Top 0.254: X1.15 3.42,10.84 6.42,13.84 6.42,22.84 v6.62,23.04 | v32.72,23.04 34.12,23.04 D2.A
  Bottom 0.254: v6.62,23.04 6.72,23.04 7.42,23.74 31.72,23.74 v32.72,23.04
RXD_5V
  Top 0.254: D2.C 38.53,22.96 JP1.3
SCL  (via drill 0.5)
  Top 0.254: R9.1 29.7,22.42 31.42,24.14 31.42,25.54 | U4.15 11.35,25.81 v12.12,25.04 | v4.42,24.84 4.42,15.24 4.02,14.84 X1.13 | U2.4 27.53,26.13 27.82,25.84 31.12,25.84 31.42,25.54 | 31.42,25.54 v32.22,25.44
  Bottom 0.254: v4.42,24.84 4.62,25.04 v12.12,25.04 12.42,24.74 13.62,24.74 14.42,25.54 v32.22,25.44
SDA  (via drill 0.5)
  Top 0.254: R8.1 4.78,26.38 v5.22,25.94 5.52,25.64 5.52,24.44 5.12,24.04 5.12,14.44 3.52,12.84 X1.14 | v12.82,25.84 12.72,25.84 11.92,26.34 11.92,27.36 U4.16 | U2.6 28.72,27.54 29.22,27.04 31.62,27.04 v31.72,27.14
  Bottom 0.254: v5.22,25.94 12.62,25.94 v12.82,25.84 13.02,25.74 13.02,26.34 13.82,27.14 v31.72,27.14
TXD  (via drill 0.5)
  Top 0.254: X1.16 2.52,8.84 7.52,13.84 7.52,21.54 v7.32,21.74
  Bottom 0.254: v7.32,21.74 25.32,21.74 26.52,22.94 30.82,22.94 31.82,21.94 37.11,21.94 JP1.2
VBUS
  Top 0.254: 34.17,10.24 C6.1 | 35.98,10.84 JP2.VBUS
  Top 0.406: U3.4 R3.2 34.17,10.24 | C6.1 34.87,10.69 35.02,10.84 35.98,10.84
VIN  (via drill 0.5)
  Top 0.254: 22.77,9.84 D5.A | C7.1 34.17,1.44 U3.3 34.27,3.24 | 36.02,3.34 v35.92,3.24
  Top 0.406: v34.32,24.24 32.52,24.24 31.62,23.34 31.62,21.74 29.62,19.74 v29.62,9.14 | v21.52,9.84 22.77,9.84 | v35.92,3.24 34.27,3.24 | v36.02,9.14 36.02,3.34
  Bottom 0.406: JP1.4 35.63,25.55 v34.32,24.24 | v21.52,9.84 22.22,9.14 v29.62,9.14 v36.02,9.14 | LSP1.MP 36.72,2.44 v35.92,3.24

### Text on the board
tPlace: - | +
tSilk: - | +